# EAGLE schematic Simple-Bug-2SC9014 (EAGLE 7.2.0)
Simple FM Transmitter with Electret Microphone, based on NPN Transistor
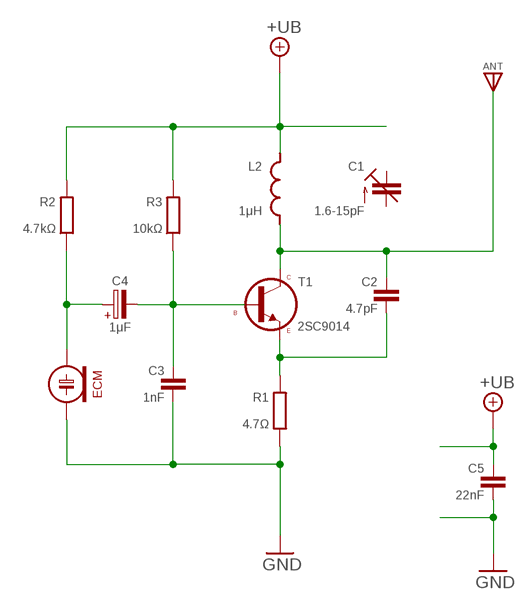
[diagram p0: schematic, sheet 1]

## Parts
ANT  ANT  [SPAD]
C1  1.6-15pF  C-TR-PH20127  [TRIM-2222-808]
C2  4.7pF  C050-020X036  [C050-020X036]
C3  1nF  C050-020X036/V  [C050-020X036/V]
C4  1μF  CPOLE2,5-3/V  [E2,5-3/V]
C5  22nF  C050-020X036/V  [C050-020X036/V]
ECM  ECM-4  [ECM-4]
L2  1μH  L-SHORT04/7V  [L-04/8V]
R1  4.7Ω  R0204/2V  [0204/2V]
R2  4.7kΩ  R0204/7-V  [0204/7-V]
R3  10kΩ  R0204/7-V  [0204/7-V]
T1  2SC9014  [TO92-EBC]

## Nets
+UB: C5.1 L2.2 R2.1 R3.1
GND: C3.2 C5.2 ECM.2(-) R1.2
N$2: ANT.1 C2.1 L2.1 T1.C
N$3: C2.2 R1.1 T1.E
N$5: C3.1 C4.- R3.2 T1.B
N$6: C4.+ ECM.1(+) R2.2
Unconnected: C1.1(A) C1.2(E) C1.3(A)

## Library data of the parts
ANT = pad:ANT
C1 = cap-trim:C-TR-PH20127
C2 C3 C5 = c:C: CAPACITOR, European symbol
C4 = c:CPOL: POLARIZED CAPACITOR, European symbol
ECM = ECM:ECM
L2 = l:L-SHORT
R1-R3 = r:R: RESISTOR, European symbol
T1 = t:2SC9014

## Net classes
0 default: width 0.61 mm